# EAGLE design Tester (EAGLE 9.6.2)
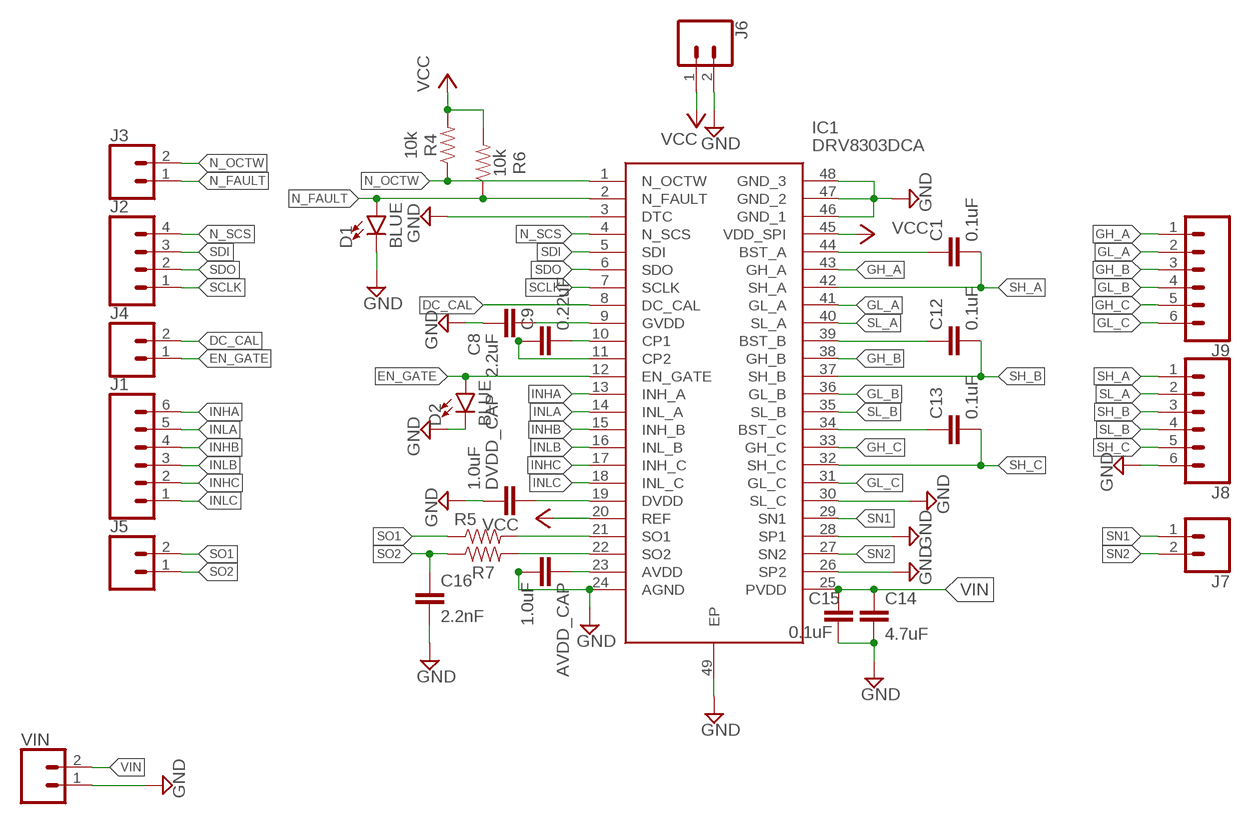
[diagram p0: schematic, sheet 1]

## Parts
AVDD_CAP  1.0uF  1.0UF-0603-16V-10%  [0603]
C1  0.1uF  0.1UF-0603-25V-(+80/-20%)  [0603]
C8  2.2uF  2.2UF-0603-10V-20%  [0603]
C9  0.22uF  0.22UF-0603-25V-10%  [0603]
C12  0.1uF  0.1UF-0603-25V-(+80/-20%)  [0603]
C13  0.1uF  0.1UF-0603-25V-(+80/-20%)  [0603]
C14  4.7uF  4.7UF-0603-35V-(20%)  [0603]
C15  0.1uF  0.1UF-0603-25V-(+80/-20%)  [0603]
C16  2.2nF  2.2NF/2200PF-0603-50V-10%  [0603]
D1  BLUE  LED-BLUE0603  [LED-0603]
D2  BLUE  LED-BLUE0603  [LED-0603]
DVDD_CAP  1.0uF  1.0UF-0603-16V-10%  [0603]
IC1  DRV8303DCA  [SOP50P810X120-49N]
J1  CONN_06SILK_FEMALE_PTH  [1X06]
J2  CONN_04PTH  [1X04]
J3  CONN_02  [1X02]
J4  CONN_02  [1X02]
J5  CONN_02  [1X02]
J6  CONN_02  [1X02]
J7  CONN_02  [1X02]
J8  CONN_06SILK_FEMALE_PTH  [1X06]
J9  CONN_06SILK_FEMALE_PTH  [1X06]
R4  10k  10KOHM-0603-1/10W-1%  [0603]
R5  0  0OHM-0603-1/10W  [0603]
R6  10k  10KOHM-0603-1/10W-1%  [0603]
R7  0  0OHM-0603-1/10W  [0603]
VIN  CONN_02LOCK_LONGPADS  [1X02_LOCK_LONGPADS]

## Nets
DC_CAL: IC1.8(DC_CAL) J4.2
EN_GATE: D2.A IC1.12(EN_GATE) J4.1
GH_A: IC1.43(GH_A) J9.1
GH_B: IC1.38(GH_B) J9.3
GH_C: IC1.33(GH_C) J9.5
GL_A: IC1.41(GL_A) J9.2
GL_B: IC1.36(GL_B) J9.4
GL_C: IC1.31(GL_C) J9.6
GND: AVDD_CAP.2 C8.2 C14.2 C15.2 C16.2 D1.C D2.C DVDD_CAP.1 IC1.3(DTC) IC1.24(AGND) IC1.26(SP2) IC1.28(SP1) IC1.30(SL_C) IC1.46(GND_1) IC1.47(GND_2) IC1.48(GND_3) IC1.49(EP) J6.2 J8.6 VIN.1
INHA: IC1.13(INH_A) J1.6
INHB: IC1.15(INH_B) J1.4
INHC: IC1.17(INH_C) J1.2
INLA: IC1.14(INL_A) J1.5
INLB: IC1.16(INL_B) J1.3
INLC: IC1.18(INL_C) J1.1
N$1: IC1.21(SO1) R5.2
N$2: C1.1 IC1.44(BST_A)
N$3: IC1.22(SO2) R7.2
N$9: C12.1 IC1.39(BST_B)
N$14: C13.1 IC1.34(BST_C)
N$32: C8.1 IC1.9(GVDD)
N$33: C9.2 IC1.10(CP1)
N$34: C9.1 IC1.11(CP2)
N$43: DVDD_CAP.2 IC1.19(DVDD)
N$47: AVDD_CAP.1 IC1.23(AVDD)
N_FAULT: D1.A IC1.2(N_FAULT) J3.1 R6.1
N_OCTW: IC1.1(N_OCTW) J3.2 R4.1
N_SCS: IC1.4(N_SCS) J2.4
SCLK: IC1.7(SCLK) J2.1
SDI: IC1.5(SDI) J2.3
SDO: IC1.6(SDO) J2.2
SH_A: C1.2 IC1.42(SH_A) J8.1
SH_B: C12.2 IC1.37(SH_B) J8.3
SH_C: C13.2 IC1.32(SH_C) J8.5
SL_A: IC1.40(SL_A) J8.2
SL_B: IC1.35(SL_B) J8.4
SN1: IC1.29(SN1) J7.1
SN2: IC1.27(SN2) J7.2
SO1: J5.2 R5.1
SO2: C16.1 J5.1 R7.1
VCC: IC1.20(REF) IC1.45(VDD_SPI) J6.1 R4.2 R6.2
VIN: C14.1 C15.1 IC1.25(PVDD) VIN.2

## Library data of the parts
AVDD_CAP DVDD_CAP = SparkFun-Capacitors:1.0UF: 1µF ceramic capacitors A capacitor is a passive two-terminal electrical component used to store electrical energy temporarily in an electric field.; PROD_ID: CAP-00868
C1 C12 C13 C15 = SparkFun-Capacitors:0.1UF: 0.1µF ceramic capacitors A capacitor is a passive two-terminal electrical component used to store electrical energy temporarily in an electric field.; PROD_ID: CAP-00810
C8 = SparkFun-Capacitors:2.2UF: 2.2µF ceramic capacitors A capacitor is a passive two-terminal electrical component used to store electrical energy temporarily in an electric field.; PROD_ID: CAP-07888
C9 = SparkFun-Capacitors:0.22UF: 0.22µF ceramic capacitors A capacitor is a passive two-terminal electrical component used to store electrical energy temporarily in an electric field.; PROD_ID: CAP-07822
C14 = SparkFun-Capacitors:4.7UF: 4.7µF ceramic capacitors A capacitor is a passive two-terminal electrical component used to store electrical energy temporarily in an electric field.; PROD_ID: CAP-14106
C16 = SparkFun-Capacitors:2.2NF/2200PF: 2.2nF/2,200pF ceramic capacitors A capacitor is a passive two-terminal electrical component used to store electrical energy temporarily in an electric field.; PROD_ID: CAP-07877
D1 D2 = SparkFun-LED:LED-BLUE: Blue SMD LED Used in manufacturing of various products at SparkFun Packages: 0603 - SMD 0603 package [Product Link] <http://www.digikey.com/product-detail/en/SMLE12BC7TT86/511-1589-2-ND/1641808> 1206 - SMD1206 package [Product Link] <http://www.digikey.com/product-detail/en/lite-on-inc/LTST-C150TBKT/160-1643-1-ND/573584> SparkFun Products: ESP8266 Thing-Dev Board <https://www.sparkfun.com/products/13711> RedBoard <https://www.sparkfun.com/products/12757>; PROD_ID: DIO-08575
IC1 = DRV8303DCA:DRV8303DCA: Texas Instruments DRV8303DCA, Three-Phase Gate Driver With Dual-Current Shunt Source: Datasheet <https://componentsearchengine.com/Datasheets/2/DRV8303DCA.pdf>; ARROW_PART_NUMBER: DRV8303DCA; ARROW_PRICE-STOCK: https://www.arrow.com/en/products/drv8303dca/texas-instruments; DESCRIPTION: Texas Instruments DRV8303DCA, Three-Phase Gate Driver With Dual-Current Shunt; HEIGHT: 1.2mm; MANUFACTURER_NAME: Texas Instruments; MANUFACTURER_PART_NUMBER: DRV8303DCA; MOUSER_PART_NUMBER: 595-DRV8303DCA; MOUSER_PRICE-STOCK: https://www.mouser.co.uk/ProductDetail/Texas-Instruments/DRV8303DCA?qs=igp4D3uu33KLowzNFy6WPA%3D%3D
J1 J8 J9 = SparkFun-Connectors:CONN_06: Multi connection point. Often used as Generic Header-pin footprint for 0.1 inch spaced/style header connections On any of the 0.1 inch spaced packages, you can populate with these: Break Away Headers - Straight <https://www.sparkfun.com/products/116> (PRT-00116) Break Away Male Headers - Right Angle <https://www.sparkfun.com/products/553> (PRT-00553) Female Headers <https://www.sparkfun.com/products/115> (PRT-00115) Break Away Headers - Machine Pin <https://www.sparkfun.com/products/117> (PRT-00117) Break Away Female Headers - Swiss Machine Pin <https://www.sparkfun.com/products/743> (PRT-00743) Arduino Stackable Header - 6 Pin <https://www.sparkfun.com/products/9280> (PRT-09280) For SCREWTERMINALS and SPRING TERMINALS visit here: Screw Terimnals on SparkFun.com <https://www.sparkfun.com/search/results?term=Screw+Terminals> (5mm/3.5mm/2.54mm spacing) This device is also useful as a general connection point to wire up your design to another part of your project. Our various solder wires solder well into these plated through hole pads. Hook-Up Wire - Assortment (Stranded, 22 AWG) <https://www.sparkfun.com/products/11375> (PRT-11375) Hook-Up Wire - Assortment (Solid Core, 22 AWG) <https://www.sparkfun.com/products/11367> (PRT-11367) View the entire wire category on our website here <https://www.sparkfun.com/categories/141>; PROD_ID: CONN-08437
J2 = SparkFun-Connectors:CONN_04: Multi connection point. Often used as Generic Header-pin footprint for 0.1 inch spaced/style header connections On any of the 0.1 inch spaced packages, you can populate with these: Break Away Headers - Straight <https://www.sparkfun.com/products/116> (PRT-00116) Break Away Male Headers - Right Angle <https://www.sparkfun.com/products/553> (PRT-00553) Female Headers <https://www.sparkfun.com/products/115> (PRT-00115) Break Away Headers - Machine Pin <https://www.sparkfun.com/products/117> (PRT-00117) Break Away Female Headers - Swiss Machine Pin <https://www.sparkfun.com/products/743> (PRT-00743) For SCREWTERMINALS and SPRING TERMINALS visit here: Screw Terimnals on SparkFun.com <https://www.sparkfun.com/search/results?term=Screw+Terminals> (5mm/3.5mm/2.54mm spacing) This device is also useful as a general connection point to wire up your design to another part of your project. Our various solder wires solder well into these plated through hole pads. Hook-Up Wire - Assortment (Stranded, 22 AWG) <https://www.sparkfun.com/products/11375> (PRT-11375) Hook-Up Wire - Assortment (Solid Core, 22 AWG) <https://www.sparkfun.com/products/11367> (PRT-11367) View the entire wire category on our website here <https://www.sparkfun.com/categories/141> Special notes: Molex polarized connector foot print use with SKU : PRT-08231 with associated crimp pins and housings. 1MM SMD Version SKU: PRT-10208; PROD_ID: CONN-09696
J3-J7 VIN = SparkFun-Connectors:CONN_02: Multi connection point. Often used as Generic Header-pin footprint for 0.1 inch spaced/style header connections On any of the 0.1 inch spaced packages, you can populate with these: Break Away Headers - Straight <https://www.sparkfun.com/products/116> (PRT-00116) Break Away Male Headers - Right Angle <https://www.sparkfun.com/products/553> (PRT-00553) Female Headers <https://www.sparkfun.com/products/115> (PRT-00115) Break Away Headers - Machine Pin <https://www.sparkfun.com/products/117> (PRT-00117) Break Away Female Headers - Swiss Machine Pin <https://www.sparkfun.com/products/743> (PRT-00743) For SCREWTERMINALS and SPRING TERMINALS visit here: Screw Terimnals on SparkFun.com <https://www.sparkfun.com/search/results?term=Screw+Terminals> (5mm/3.5mm/2.54mm spacing) This device is also useful as a general connection point to wire up your design to another part of your project. Our various solder wires solder well into these plated through hole pads. Hook-Up Wire - Assortment (Stranded, 22 AWG) <https://www.sparkfun.com/products/11375> (PRT-11375) Hook-Up Wire - Assortment (Solid Core, 22 AWG) <https://www.sparkfun.com/products/11367> (PRT-11367) View the entire wire category on our website here <https://www.sparkfun.com/categories/141> Special notes: Molex polarized connector foot print use with: PRT-08233 with associated crimp pins and housings. 2.54_SCREWTERM for use with PRT-10571. 3.5mm Screw Terminal footprints for PRT-08084 5mm Screw Terminal footprints for use with PRT-08432
R4 R6 = SparkFun-Resistors:10KOHM: 10kΩ resistor A resistor is a passive two-terminal electrical component that implements electrical resistance as a circuit element. Resistors act to reduce current flow, and, at the same time, act to lower voltage levels within circuits. - Wikipedia; PROD_ID: RES-00824
R5 R7 = SparkFun-Resistors:0OHM: 0Ω resistor A resistor is a passive two-terminal electrical component that implements electrical resistance as a circuit element. Resistors act to reduce current flow, and, at the same time, act to lower voltage levels within circuits. - Wikipedia; PROD_ID: RES-08609

## Board
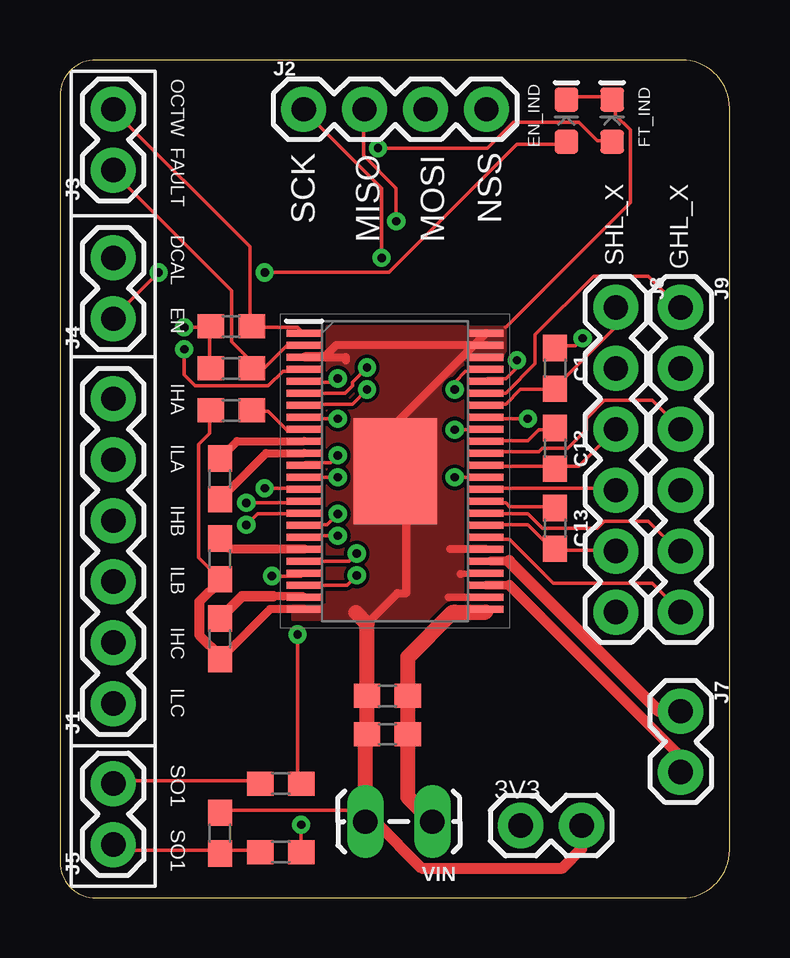
[diagram p1: board, top side]
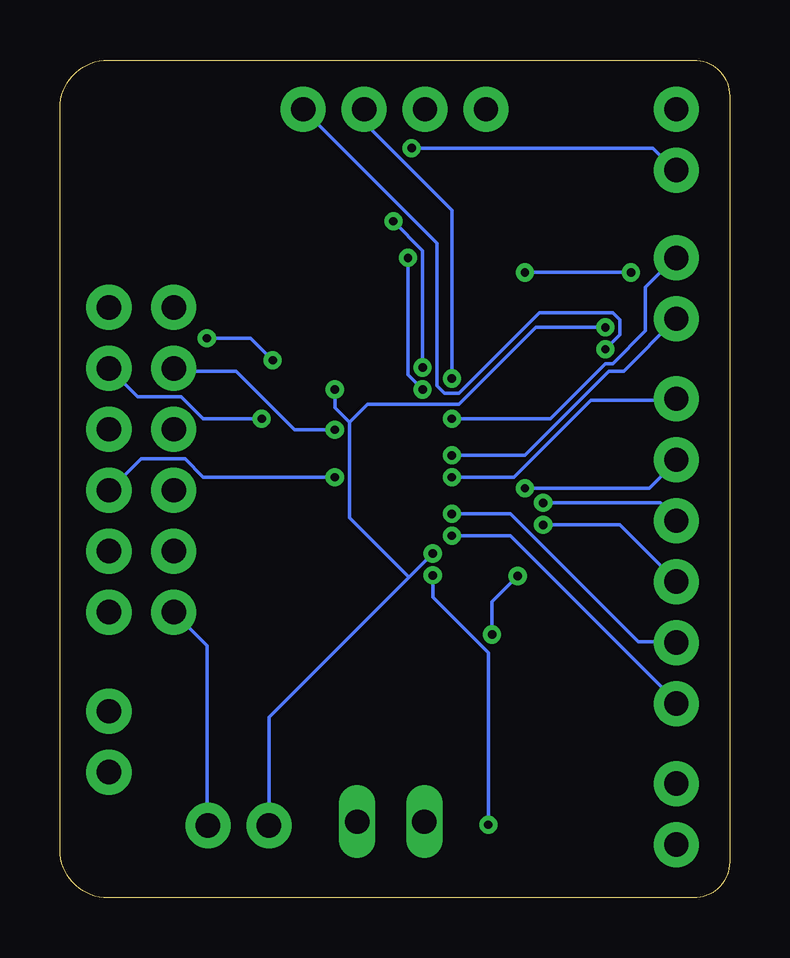
[diagram p2: board, bottom side, seen from below]

Size 27.92 x 34.91 mm. Coordinates in mm from the lower left corner, seen from the top.
Outline: 25.92,34.91 1.5,34.91 arc90 0,33.41 0,1.5 arc90 1.5,0 25.92,0 arc90 27.92,2 27.92,32.91 arc90 25.92,34.91
Copper layers (1*16): Top 0.035mm / dielectric 1.5mm / Bottom 0.035mm
Design rules "default *": minimum track width 6mil, minimum drill 0.35mm, track to track 6mil, track to pad 6mil, pad to pad 6mil, via to via 6mil, smd to smd 3mil, copper to edge 40mil, drill to drill 6mil, minimum pad ring 10mil, minimum via ring 8mil, stop-mask expansion 100mil, vias tented up to drill 14mil, thermal gap 0mil

### Footprints (pad centres in the part's own frame; a part is rotated, then mirrored left to right if it is on the bottom)
0603 = smd 1.1 x 1: 1 -0.85,0; 2 0.85,0
LED-0603 = smd 1 x 1: A -0.877,0; C 0.877,0
SOP50P810X120-49N = smd 1.475 x 0.3: 1 -3.788,5.75; 2 -3.788,5.25; 3 -3.788,4.75; 4 -3.788,4.25; 5 -3.788,3.75; 6 -3.788,3.25; 7 -3.788,2.75; 8 -3.788,2.25; 9 -3.788,1.75; 10 -3.788,1.25; 11 -3.788,0.75; 12 -3.788,0.25; 13 -3.788,-0.25; 14 -3.788,-0.75; 15 -3.788,-1.25; 16 -3.788,-1.75; 17 -3.788,-2.25; 18 -3.788,-2.75; 19 -3.788,-3.25; 20 -3.788,-3.75; 21 -3.788,-4.25; 22 -3.788,-4.75; 23 -3.788,-5.25; 24 -3.788,-5.75; 25 3.788,-5.75; 26 3.788,-5.25; 27 3.788,-4.75; 28 3.788,-4.25; 29 3.788,-3.75; 30 3.788,-3.25; 31 3.788,-2.75; 32 3.788,-2.25; 33 3.788,-1.75; 34 3.788,-1.25; 35 3.788,-0.75; 36 3.788,-0.25; 37 3.788,0.25; 38 3.788,0.75; 39 3.788,1.25; 40 3.788,1.75; 41 3.788,2.25; 42 3.788,2.75; 43 3.788,3.25; 44 3.788,3.75; 45 3.788,4.25; 46 3.788,4.75; 47 3.788,5.25; 48 3.788,5.75 | smd 3.48 x 4.42: 49 0,0
1X06 = drill 1.016 pad 1.88: 1 0,0; 2 2.54,0; 3 5.08,0; 4 7.62,0; 5 10.16,0; 6 12.7,0
1X04 = drill 1.016 pad 1.88: 1 0,0; 2 2.54,0; 3 5.08,0; 4 7.62,0
1X02 = drill 1.016 pad 1.88: 1 0,0; 2 2.54,0
1X02_LOCK_LONGPADS = drill 1.016 long: 1 -0.127,0; 2 2.667,0

### Placement (x,y rotation side)
AVDD_CAP  6.67,10.79 270 top
C1  20.64,22.07 270 top
C8  7.14,20.32 180 top
C9  6.67,17.46 90 top
C12  20.64,18.73 270 top
C13  20.64,15.4 270 top
C14  13.65,6.83 180 top
C15  13.65,8.41 180 top
C16  6.67,2.7 90 top
D1  23.02,32.38 90 top
D2  21.11,32.38 90 top
DVDD_CAP  6.67,14.13 90 top
IC1  13.97,17.78 0 top
J1  2.22,8.1 90 top
J2  10.16,32.86 0 top
J3  2.22,30.32 90 top
J4  2.22,24.13 90 top
J5  2.22,2.22 90 top
J6  19.21,3.02 0 top
J7  25.88,7.78 270 top
J8  23.18,24.61 270 top
J9  25.88,24.61 270 top
R4  7.14,23.81 180 top
R5  9.21,4.76 0 top
R6  7.14,22.07 180 top
R7  9.21,1.91 0 top
VIN  12.86,3.17 0 top

### Tracks (layer width: path | path; a pad name or v marks a point on that pad's centre or on a via)
DC_CAL  (via drill 0.35)
  Top 0.152: v11.58,19.96 10.21,19.96 IC1.8
  Bottom 0.152: v11.58,19.96 7.47,19.96 5.18,22.25 4.88,22.25 3.5,23.62 3.5,25.45 2.29,26.67 J4.2
EN_GATE  (via drill 0.35)
  Top 0.152: v8.53,26.06 13.72,26.06 19.05,31.39 21.03,31.39 D2.A | v4.12,26.06 2.29,24.23 J4.1 | v11.58,18.44 11.28,18.14 10.21,18.14 IC1.12
  Bottom 0.152: v4.12,26.06 v8.53,26.06 | v11.58,18.44 8.53,18.44 5.03,21.95 4.42,21.95 2.29,24.08 J4.1
GH_A
  Top 0.152: IC1.43 17.83,21.03 18.59,21.03 19.81,22.25 19.81,23.47 22.25,25.91 24.54,25.91 25.76,24.69 J9.1
GH_B
  Top 0.152: IC1.38 17.83,18.59 19.96,18.59 20.12,18.75 21.18,18.75 21.95,19.51 21.95,19.96 22.71,20.73 24.69,20.73 25.76,19.66 J9.3
GH_C
  Top 0.152: IC1.33 17.83,16 19.51,16 20.12,15.39 22.4,15.39 22.71,15.7 24.54,15.7 25.76,14.48 J9.5
GL_A  (via drill 0.35)
  Top 0.152: v19.51,19.96 17.83,19.96 IC1.41
  Bottom 0.152: v19.51,19.96 21.95,19.96 22.86,20.88 24.69,20.88 J9.2
GL_B  (via drill 0.35)
  Top 0.152: v16.46,17.53 17.68,17.53 IC1.36
  Bottom 0.152: v16.46,17.53 21.95,17.53 22.71,18.29 24.54,18.29 25.76,17.07 J9.4
GL_C
  Top 0.152: IC1.31 17.83,14.94 18.75,14.94 20.57,13.11 24.69,13.11 25.76,12.04 J9.6
GND
  Top 0.152: D2.C 21.18,33.38 23.01,33.38 D1.C 23.16,33.22 23.16,32.61 23.77,32 23.77,28.96 18.59,23.77 18.57,23.77 | C16.2 6.71,3.66 12.56,3.66 VIN.1 12.96,3.05 | C8.2 6.25,20.27 6.25,19.36 5.79,18.9 5.79,14.17 6.55,13.41 DVDD_CAP.1 | 21.64,2.91 J6.2
  Top 0.279: IC1.28 17.76,13.5 16.7,13.5
  Top 0.305: IC1.26 16.19,12.53
  Top 0.33: IC1.24 8.75,12.03 AVDD_CAP.2 | 11.91,22.38 11.91,22.53 IC1.3 10.21,22.56 11.05,22.56 11.52,23.03 IC1.47 | 16.7,13.5 16.7,13.49 | IC1.30 16.27,14.53 | IC1.48 13.97,19.74 13.97,17.94 | 13.97,17.94 IC1.49 | 12.8,11.43 14.07,12.7 14.45,12.7 14.45,17.46 13.97,17.94
  Top 0.406: DVDD_CAP.1 6.67,13.2 5.81,12.34 5.81,10.95 6.67,10.09 AVDD_CAP.2
  Top 0.457: VIN.1 13.15,3.17 15.08,1.25 20.95,1.25 21.75,2.04 J6.2
  Top 0.635: VIN.1 12.73,6.75 C14.2 C15.2 12.8,11.43 12.34,11.89 | 12.8,16.61 IC1.49
  Bottom 0.152: J6.2 21.79,3.06 21.79,10.52 23.16,11.89 J8.6
  pour Top (rank 2, no thermals): 11.11,23.81 11.11,11.59 16.83,11.59 16.83,23.81
  pour Top (rank 2, no thermals): 16.83,23.81 18.57,23.81 18.57,22.38 16.83,22.38
  pour Top (rank 2, no thermals): 9.68,12.22 9.68,11.59 11.59,11.59 11.75,11.59 11.75,12.22
INHA  (via drill 0.35)
  Top 0.152: v11.58,17.53 10.21,17.53 IC1.13
  Bottom 0.152: v11.58,17.53 8.99,17.53 5.79,20.73 2.29,20.73 J1.6
INHB  (via drill 0.35)
  Top 0.152: v7.77,16.46 10.06,16.46 IC1.15
  Bottom 0.152: v7.77,16.46 2.9,16.46 2.29,15.85 J1.4
INHC  (via drill 0.35)
  Top 0.152: v11.58,16 11.12,15.54 10.21,15.54 IC1.17
  Bottom 0.152: v11.58,16 9.14,16 3.81,10.67 2.29,10.67 J1.2
INLA  (via drill 0.35)
  Top 0.152: v8.53,17.07 10.06,17.07 IC1.14
  Bottom 0.152: v8.53,17.07 3.35,17.07 2.29,18.14 J1.5
INLB  (via drill 0.35)
  Top 0.152: v7.77,15.54 8.23,16 10.06,16 IC1.16
  Bottom 0.152: v7.77,15.54 4.57,15.54 2.29,13.26 J1.3
INLC  (via drill 0.35)
  Top 0.152: v11.58,15.09 10.21,15.09 IC1.18
  Bottom 0.152: v11.58,15.09 9.14,15.09 2.29,8.23 J1.1
N$1  (via drill 0.35)
  Top 0.152: v9.91,10.97 9.91,4.88 R5.2 | v8.84,13.41 10.06,13.41 IC1.21
  Bottom 0.152: v9.91,10.97 9.91,12.34 v8.84,13.41
N$2  (via drill 0.35)
  Top 0.152: v21.79,23.32 21.49,23.01 20.73,23.01 C1.1 | v19.05,22.4 19.05,22.1 18.59,21.64 17.83,21.64 IC1.44
  Bottom 0.152: v21.79,23.32 19.96,23.32 v19.05,22.4
N$3  (via drill 0.35)
  Top 0.152: v10.06,3.05 10.06,1.98 R7.2 | IC1.22 11.97,13.03 v12.38,13.44
  Bottom 0.152: v10.06,3.05 10.06,10.21 12.38,12.53 v12.38,13.44
N$9
  Top 0.152: C12.1 20.57,19.51 19.96,19.51 19.51,19.05 17.83,19.05 IC1.39
N$14
  Top 0.152: C13.1 20.57,16.31 18.75,16.31 18.59,16.46 17.83,16.46 IC1.34
N$32
  Top 0.152: C8.1 8.08,20.27 8.69,20.27 9.45,19.51 10.06,19.51 IC1.9
N$33
  Top 0.33: C9.2 7.38,19.03 IC1.10
N$34
  Top 0.33: C9.1 8.59,18.53 IC1.11
N$43
  Top 0.381: IC1.19 7.12,14.53 DVDD_CAP.2
N$47
  Top 0.33: IC1.23 10.15,12.56 9.31,12.56 8.89,12.56
  Top 0.432: AVDD_CAP.1 7.59,12.56 8.89,12.56
N_FAULT  (via drill 0.35)
  Top 0.152: IC1.2 10.06,23.01 9.45,23.01 8.53,22.1 8.08,22.1 R6.1 7.92,22.1 7.92,22.4 7.16,23.16 7.16,25.3 2.29,30.18 J3.1 | v13.26,31.24 17.83,31.24 18.9,32.31 21.64,32.31 22.4,31.55 23.01,31.55 D1.A
  Bottom 0.152: v13.26,31.24 3.2,31.24 2.29,30.33 J3.1
N_OCTW
  Top 0.152: IC1.1 10.06,23.62 9.91,23.77 8.08,23.77 R4.1 7.92,23.93 7.92,27.13 2.29,32.77 J3.2
N_SCS  (via drill 0.35)
  Top 0.152: v5.18,22.86 5.18,21.79 5.64,21.34 8.69,21.34 9.3,21.95 10.06,21.95 IC1.4
  Bottom 0.152: v5.18,22.86 4.57,23.47 4.57,24.08 4.88,24.38 7.92,24.38 11.28,21.03 11.89,21.03 12.19,21.34 12.19,27.28 17.68,32.77 J2.4
SCLK  (via drill 0.35)
  Top 0.152: v12.8,21.18 12.19,20.57 10.21,20.57 IC1.7 | v13.41,26.67 13.41,29.57 10.21,32.77 J2.1
  Bottom 0.152: v12.8,21.18 13.41,21.79 v13.41,26.67
SDI  (via drill 0.35)
  Top 0.152: v11.58,21.64 11.43,21.49 10.21,21.49 IC1.5
  Bottom 0.152: v11.58,21.64 11.58,28.65 15.24,32.31 J2.3
SDO  (via drill 0.35)
  Top 0.152: v12.8,22.1 12.19,21.49 12.19,21.34 11.89,21.03 10.21,21.03 IC1.6 | v14.02,28.19 14.02,29.57 12.65,30.94 12.65,32.77 J2.2
  Bottom 0.152: v12.8,22.1 12.8,26.98 v14.02,28.19
SH_A
  Top 0.152: IC1.42 17.83,20.57 18.59,20.57 19.2,21.18 20.57,21.18 C1.2 20.73,21.34 23.16,23.77 23.16,24.54 J8.1
SH_B
  Top 0.152: IC1.37 17.83,17.98 20.57,17.98 C12.2 20.73,17.98 21.64,17.98 23.16,19.51 J8.3
SH_C
  Top 0.152: J8.5 23.16,14.48 20.73,14.48 C13.2 20.57,14.48 19.51,15.54 17.83,15.54 IC1.32
SL_A  (via drill 0.35)
  Top 0.152: v16.46,19.51 17.68,19.51 IC1.40
  Bottom 0.152: v16.46,19.51 18.14,19.51 20.57,21.95 23.16,21.95 J8.2
SL_B
  Top 0.152: IC1.35 17.83,17.07 23.16,17.07 J8.4
SN1
  Top 0.152: IC1.29 17.83,14.02 17.97,14.04
  Top 0.381: 18.72,14.03 17.98,14.03 17.97,14.04
  Top 0.508: J7.1 24.97,7.78 18.72,14.03
SN2
  Top 0.305: IC1.27 17.77,13.02
  Top 0.356: 17.77,13.02 18.73,13.02
  Top 0.432: 18.73,13.02 25.88,5.87 J7.2
SO1
  Top 0.152: R5.1 8.23,4.88 2.29,4.88 J5.2
SO2
  Top 0.152: R7.1 8.23,1.98 6.71,1.98 C16.1 6.55,1.98 2.44,1.98 2.29,2.13 J5.1
VCC  (via drill 0.35)
  Top 0.152: 6.25,23.77 6.25,22.1 R6.2 | v12.38,14.35 12.05,14.02 10.21,14.02 IC1.20 | v16.46,21.18 16.46,21.49 16.92,21.95 17.68,21.95 IC1.45 | v5.18,23.77 6.25,23.77 | 6.25,23.77 R4.2
  Bottom 0.152: 13.36,13.36 v12.38,14.35 | J6.1 19.2,3.06 19.2,7.53 13.36,13.36 | v16.46,21.18 16.46,20.42 15.85,19.81 | 15.85,19.81 15.85,15.85 13.36,13.36 | v5.18,23.77 8.08,23.77 11.28,20.57 15.09,20.57 15.85,19.81
VIN
  Top 0.152: 17.07,11.91 17.07,12.04 IC1.25
  Top 0.635: VIN.2 14.5,4.2 C14.1 C15.1 14.5,10.04 16.36,11.89 16.46,11.89 16.47,11.91 17.07,11.91 17.76,11.91

### Text on the board
tPlace: OCTW | FAULT | EN_IND | FT_IND | DCAL | SCK | NSS | MISO | MOSI | SHL_X | GHL_X | EN | IHA | ILA | IHB | ILB | IHC | ILC | SO1 | 3V3 | SO1